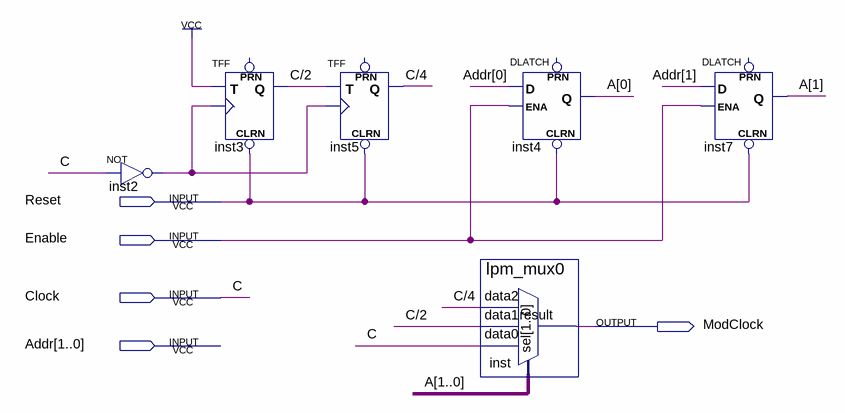
[diagram p0: schematic sheet]
// Quartus schematic speed_loader.bdf as structural Verilog: 6 symbols, 5 pins
module speed_loader (
  input  Reset,
  input  Enable,
  input  Clock,
  input  [1:0] Addr,
  output ModClock
);

  wire \C/2 , \C/4 , inst2_out;
  wire [1:0] A;

  not inst2 (inst2_out, Clock);
  TFF inst3 (.CLRN(Reset), .T(1'b1), .CLK(inst2_out), .Q(\C/2 ));  // open: PRN
  TFF inst5 (.CLRN(Reset), .T(\C/2 ), .CLK(inst2_out), .Q(\C/4 ));  // open: PRN
  DLATCH inst4 (.CLRN(Reset), .D(Addr[0]), .ENA(Enable), .Q(A[0]));  // open: PRN
  lpm_mux0 inst (.data2(\C/4 ), .data1(\C/2 ), .data0(Clock), .sel(A), .result(ModClock));
  DLATCH inst7 (.CLRN(Reset), .D(Addr[1]), .ENA(Enable), .Q(A[1]));  // open: PRN

  // Other names for the same wires on the sheet: C = Clock
endmodule
